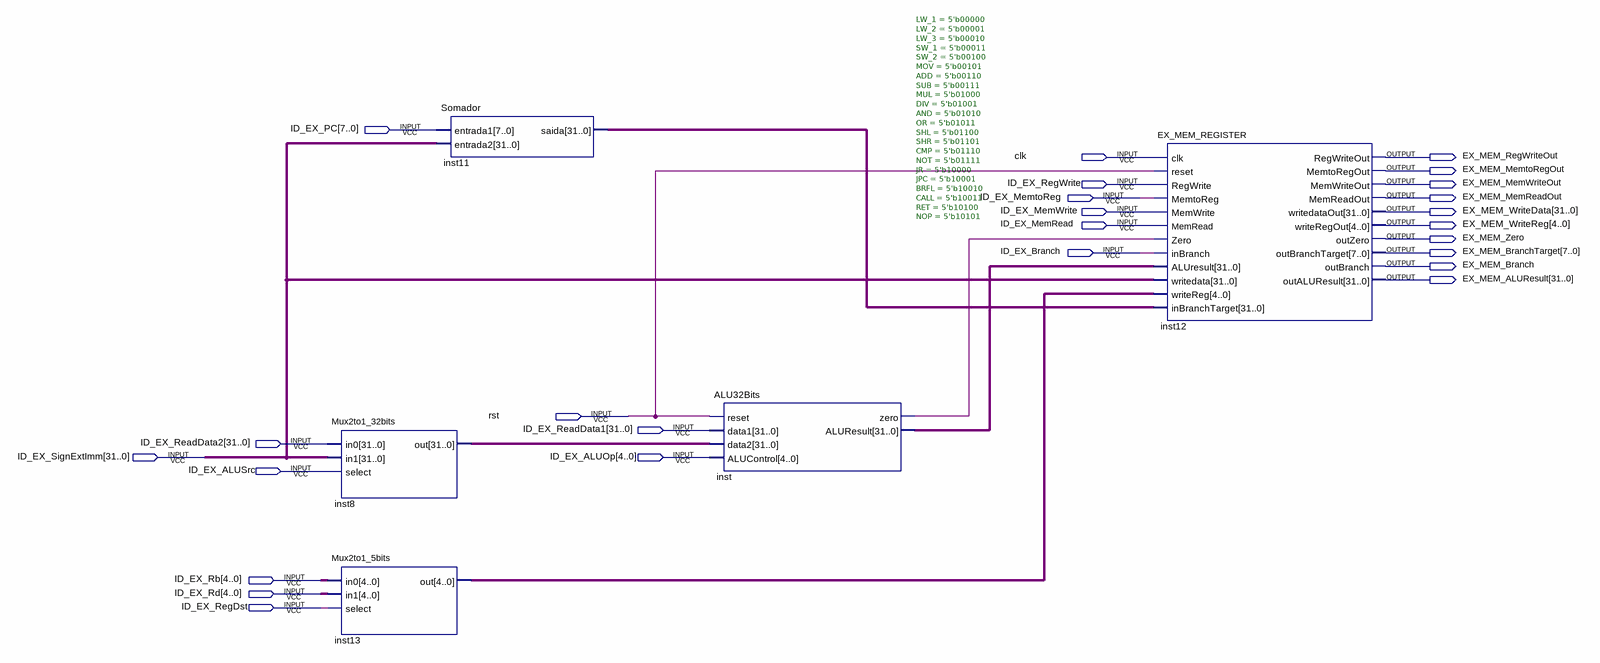
[diagram p0: schematic sheet]
// Quartus schematic EX_STAGE.bdf as structural Verilog: 5 symbols, 26 pins
module EX_STAGE (
  input  [7:0] ID_EX_PC,
  input  clk,
  input  ID_EX_RegWrite,
  input  ID_EX_MemtoReg,
  input  ID_EX_MemWrite,
  input  ID_EX_MemRead,
  input  ID_EX_Branch,
  input  rst,
  input  [31:0] ID_EX_ReadData1,
  input  [31:0] ID_EX_ReadData2,
  input  [31:0] ID_EX_SignExtImm,
  input  [4:0] ID_EX_ALUOp,
  input  ID_EX_ALUSrc,
  input  [4:0] ID_EX_Rb,
  input  [4:0] ID_EX_Rd,
  input  ID_EX_RegDst,
  output EX_MEM_RegWriteOut,
  output EX_MEM_MemtoRegOut,
  output EX_MEM_MemWriteOut,
  output EX_MEM_MemReadOut,
  output [31:0] EX_MEM_WriteData,
  output [4:0] EX_MEM_WriteReg,
  output EX_MEM_Zero,
  output [7:0] EX_MEM_BranchTarget,
  output EX_MEM_Branch,
  output [31:0] EX_MEM_ALUResult
);

  wire inst_zero;
  wire [4:0] inst13_out;
  wire [31:0] inst8_out, inst11_saida, inst_aluresult;

  Mux2to1_32bits inst8 (.in0(ID_EX_ReadData2), .in1(ID_EX_SignExtImm), .select(ID_EX_ALUSrc), .out(inst8_out));
  Mux2to1_5bits inst13 (.in0(ID_EX_Rb), .in1(ID_EX_Rd), .select(ID_EX_RegDst), .out(inst13_out));
  Somador inst11 (.entrada1(ID_EX_PC), .entrada2(ID_EX_SignExtImm), .saida(inst11_saida));
  ALU32Bits #(.LW_1(5'b00000), .LW_2(5'b00001), .LW_3(5'b00010), .SW_1(5'b00011), .SW_2(5'b00100), .MOV(5'b00101), .ADD(5'b00110), .SUB(5'b00111), .MUL(5'b01000), .DIV(5'b01001), .AND(5'b01010), .OR(5'b01011), .SHL(5'b01100), .SHR(5'b01101), .CMP(5'b01110), .NOT(5'b01111), .JR(5'b10000), .JPC(5'b10001), .BRFL(5'b10010), .CALL(5'b10011), .RET(5'b10100), .NOP(5'b10101)) inst (
    .reset(rst), .data1(ID_EX_ReadData1), .data2(inst8_out), .ALUControl(ID_EX_ALUOp), .zero(inst_zero),
    .ALUResult(inst_aluresult));
  EX_MEM_REGISTER inst12 (
    .clk(clk), .reset(rst), .RegWrite(ID_EX_RegWrite), .MemtoReg(ID_EX_MemtoReg), .MemWrite(ID_EX_MemWrite),
    .MemRead(ID_EX_MemRead), .Zero(inst_zero), .inBranch(ID_EX_Branch), .ALUresult(inst_aluresult),
    .writedata(ID_EX_SignExtImm), .writeReg(inst13_out), .inBranchTarget(inst11_saida),
    .RegWriteOut(EX_MEM_RegWriteOut), .MemtoRegOut(EX_MEM_MemtoRegOut), .MemWriteOut(EX_MEM_MemWriteOut),
    .MemReadOut(EX_MEM_MemReadOut), .writedataOut(EX_MEM_WriteData), .writeRegOut(EX_MEM_WriteReg),
    .outZero(EX_MEM_Zero), .outBranchTarget(EX_MEM_BranchTarget), .outBranch(EX_MEM_Branch),
    .outALUResult(EX_MEM_ALUResult));
endmodule
